# Altium schematic sheet Power.SchDoc
size A; SheetNumber: 2; SheetTotal: 4
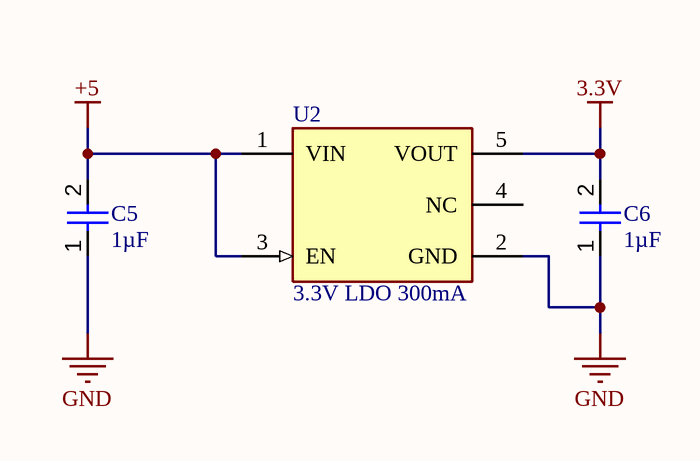
[diagram p0: Power.SchDoc]

## Parts
C5  value 1µF  [CAP_0603]  (hidden comment: CAP 1uF)
C6  value 1µF  [CAP_0603]  (hidden comment: CAP 1uF)
U2  3.3V LDO 300mA  [FP-SOT23-5LD-PL-1-MFG]

## Nets
3.3V: C6.2 U2.5(VOUT)
+5: C5.2 U2.1(VIN) U2.3(EN)
GND: C5.1 C6.1 U2.2(GND)

Not connected (* = marked no-connect by the designer): U2 4(NC)

## Library data of the parts
C5 C6 = CMP-001-00085-1: Capacitor 1uF 10% 16V 0603; Source: Generic_Schematic_Library.SchLib; Voltage Rating: 16V; Design Item ID: CAP 1uF; Tolerance: 10%
U2 = CMP-00031-1: Fixed Positive LDO Regulator, 3.3V, 0.38V Dropout, CMOS, PDSO5; RoHS Compliant: Yes